# Altium schematic sheet RFOUT DaughterBoard.SchDoc
size A4; SheetNumber: 1; SheetTotal: 3
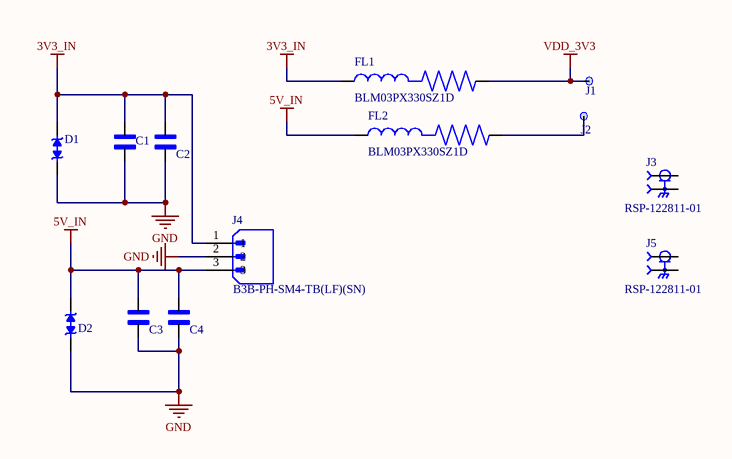
[diagram p0: RFOUT DaughterBoard.SchDoc]

## Parts
C1  CC0603KRX5R9BB105  [CAPC1608X90]  (value not drawn)
C2  CC0603KRX5R9BB105  [CAPC1608X90]  (value not drawn)
C3  CC0603KRX5R9BB105  [CAPC1608X90]  (value not drawn)
C4  CC0603KRX5R9BB105  [CAPC1608X90]  (value not drawn)
D1  TESDL5V0B12P1Q0_M7G  [DFN61X31X34-2N]  (value not drawn)
D2  TESDL5V0B12P1Q0_M7G  [DFN61X31X34-2N]  (value not drawn)
FL1  BLM03PX330SZ1D  [BEADC0603X33N]
FL2  BLM03PX330SZ1D  [BEADC0603X33N]
J1  Testpoint, Surface, 1.0mm  [TP_1mm_UN1Q]  (value not drawn)  (no BOM)
J2  Testpoint, Surface, 1.0mm  [TP_1mm_UN1Q]  (value not drawn)  (no BOM)
J3  RSP-122811-01  [SAMTEC_RSP-122811-01]
J4  B3B-PH-SM4-TB(LF)(SN)  [JST_B3B-PH-SM4-TB(LF)(SN)]
J5  RSP-122811-01  [SAMTEC_RSP-122811-01]

## Nets
3V3_IN: C1.1 C2.1 D1.2 FL1.1 J4.1
5V_IN: C3.1 C4.1 D2.2 FL2.1 J4.3
GND: C1.2 C2.2 C3.2 C4.2 D1.1 D2.1 J4.2
VDD_3V3: FL1.2 J1.1(TP)
NetFL2_2: FL2.2 J2.1(TP)
NetJ3_G1: J3.G1(GND) J3.G2(GND)
NetJ5_G1: J5.G1(GND) J5.G2(GND)

Not connected (* = marked no-connect by the designer): J3 1; J5 1

## Library data of the parts
C1-C4 = CC0603KRX5R9BB105: 1 ÂµF Â±10% 50V Ceramic Capacitor X5R 0603 (1608 Metric); MF: Yageo; SnapEDA_Link: https://www.snapeda.com/parts/CC0603KRX5R9BB105/Yageo/view-part/?ref=snap; Package: 0603 Yageo; Value: *; MP: CC0603KRX5R9BB105; Check_prices: https://www.snapeda.com/parts/CC0603KRX5R9BB105/Yageo/view-part/?ref=eda
D1 D2 = TESDL5V0B12P1Q0_M7G: MF: {'manufacturer': u'Taiwan Semiconductor'}; Package: None; Price: None; Value: *; MP: TESDL5V0B12P1Q0_M7G; Availability: Unavailable
FL1 FL2 = BLM03PX330SZ1D: 33 Ohms @ 100 MHz 1 Power Line Ferrite Bead 0201 (0603 Metric) 1.5A 55mOhm; MF: Murata; SnapEDA_Link: https://www.snapeda.com/parts/BLM03PX330SZ1D/Murata/view-part/?ref=snap; Package: 0603 Murata; Value: *; MP: BLM03PX330SZ1D; Check_prices: https://www.snapeda.com/parts/BLM03PX330SZ1D/Murata/view-part/?ref=eda
J1 J2 = CMP-001-000153-12: Testpoint 1.0mm; Part Number: TP 1mm; Sort order: -; HasBeenBuilt: -; ClassName: SMALL; ComponentLink1Description: 1_Datasheet; ComponentLink2Description: 2_Product page; ComponentLink3Description: 3_X-information; ComponentLink4Description: 4_X-information; Creation date: 20200101; System: Test Point; Design Item ID: TP_1mm; Source: Conn_UN1Q.SchLib; Component Type: Test Point
J3 J5 = RSP-122811-01: MF: {'manufacturer': u'Samtec Inc.'}; Package: None; Price: None; Value: *; MP: RSP-122811-01; Availability: Unavailable
J4 = B3B-PH-SM4-TB(LF)(SN): Connector Header Surface Mount 3 position 0.079 (2.00mm); MF: JST Sales; Package: NON STANDARD-3 JST; Price: None; Value: *; SnapEDA_Link: https://www.snapeda.com/parts/B3B-PH-SM4-TB(LF)(SN)/JST+Sales+America+Inc./view-part/?ref=snap; MP: B3B-PH-SM4-TB(LF)(SN); Availability: In Stock; Check_prices: https://www.snapeda.com/parts/B3B-PH-SM4-TB(LF)(SN)/JST+Sales+America+Inc./view-part/?ref=eda